# EAGLE schematic ultrasonic-test (EAGLE 7.6.0)
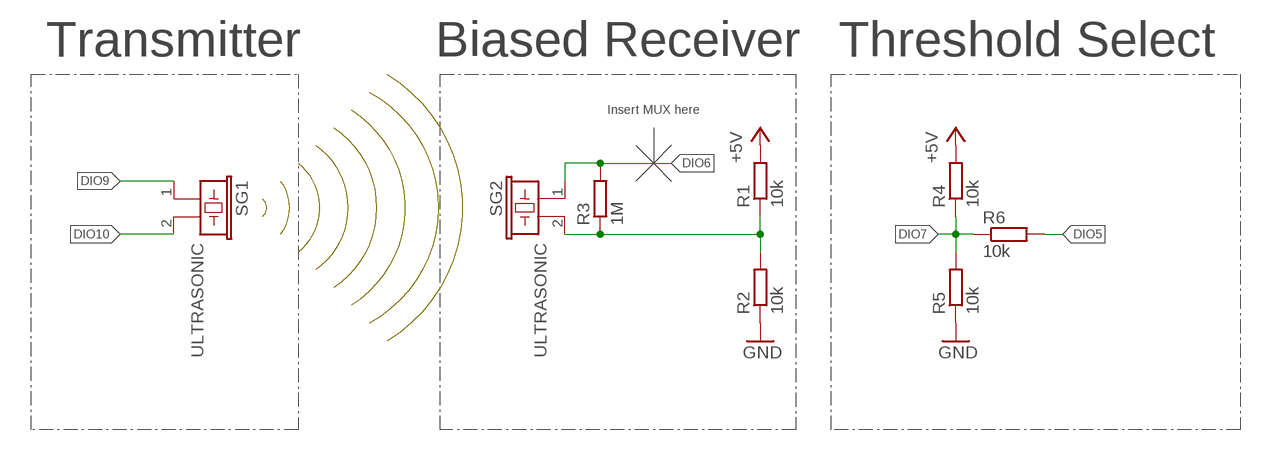
[diagram p0: schematic, sheet 1]

## Parts
R1  10k  R-EU_R0402  [R0402]
R2  10k  R-EU_R0402  [R0402]
R3  1M  R-EU_R0402  [R0402]
R4  10k  R-EU_R0402  [R0402]
R5  10k  R-EU_R0402  [R0402]
R6  10k  R-EU_R0402  [R0402]
SG1  ULTRASONIC  EFBAA40D101  [EFBAA40D101]
SG2  ULTRASONIC  EFBAA40D101  [EFBAA40D101]

## Nets
+5V: R1.2 R4.2
DIO5: R6.2
DIO6: R3.2 SG2.1
DIO7: R4.1 R5.2 R6.1
DIO9: SG1.1
DIO10: SG1.2
GND: R2.1 R5.1
N$3: R1.1 R2.2 R3.1 SG2.2

## Notes on the sheet
- Transmitter | Biased Receiver | Threshold Select
- Insert MUX here

## Library data of the parts
R1-R6 = rcl:R-EU_: RESISTOR, European symbol
SG1 SG2 = buzzer:EFB?: Piezoelectric Acoustic Transducer Source: Panbasonic .. 2SC1685.pdf; OC_FARNELL: unknown; OC_NEWARK: unknown